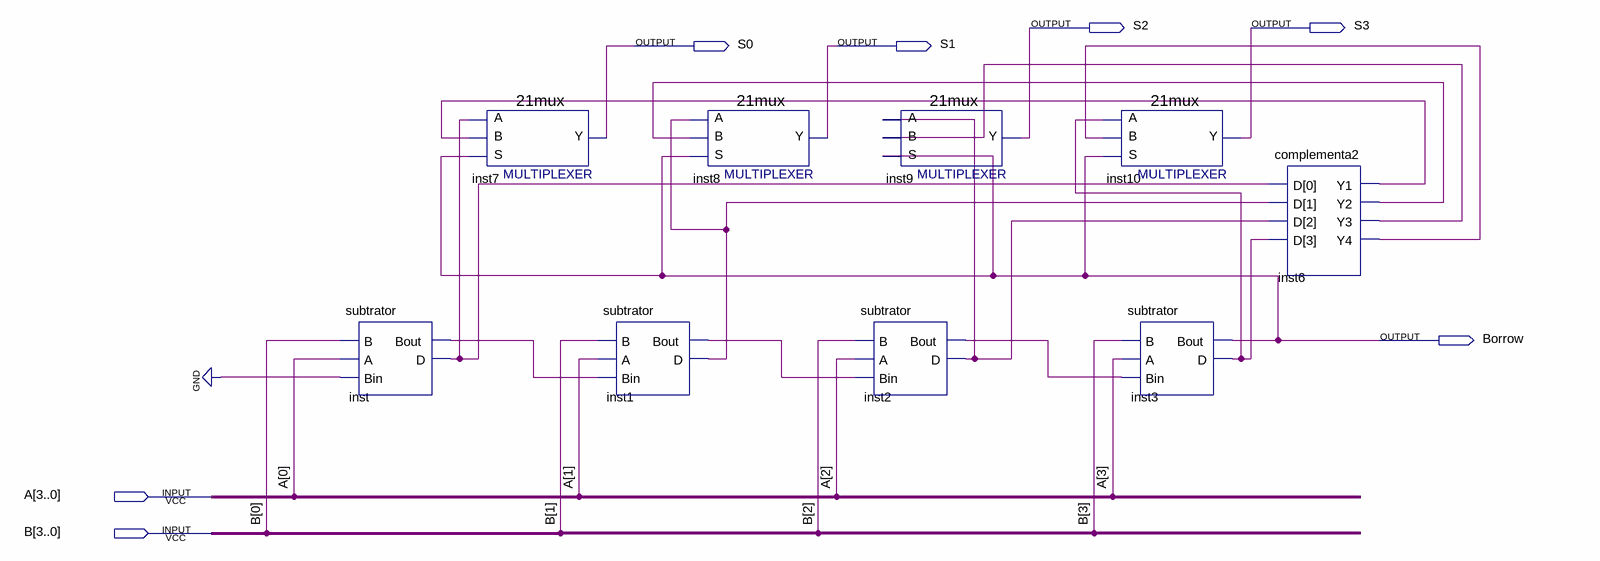
[diagram p0: schematic sheet]
// Quartus schematic subtrator4bits.bdf as structural Verilog: 9 symbols, 7 pins
module subtrator4bits (
  input  [3:0] A,
  input  [3:0] B,
  output S2,
  output S3,
  output S0,
  output S1,
  output Borrow
);

  wire inst1_bout, inst1_d, inst2_bout, inst2_d, inst3_d, inst6_y1, inst6_y2, inst6_y3, inst6_y4, inst_bout,
       inst_d;

  subtrator inst (.B(B[0]), .A(A[0]), .Bin(1'b0), .Bout(inst_bout), .D(inst_d));
  \21mux  inst7 (.S(Borrow), .B(inst6_y1), .A(inst_d), .Y(S0));
  subtrator inst1 (.B(B[1]), .A(A[1]), .Bin(inst_bout), .Bout(inst1_bout), .D(inst1_d));
  \21mux  inst8 (.S(Borrow), .B(inst6_y2), .A(inst1_d), .Y(S1));
  subtrator inst2 (.B(B[2]), .A(A[2]), .Bin(inst1_bout), .Bout(inst2_bout), .D(inst2_d));
  \21mux  inst9 (.S(Borrow), .B(inst6_y3), .A(inst2_d), .Y(S2));
  \21mux  inst10 (.S(Borrow), .B(inst6_y4), .A(inst3_d), .Y(S3));
  subtrator inst3 (.B(B[3]), .A(A[3]), .Bin(inst2_bout), .Bout(Borrow), .D(inst3_d));
  complementa2 inst6 (
    .D({inst3_d, inst2_d, inst1_d, inst_d}), .Y1(inst6_y1), .Y2(inst6_y2), .Y3(inst6_y3), .Y4(inst6_y4));
endmodule
